# EAGLE design btmat (EAGLE 8.2.1)
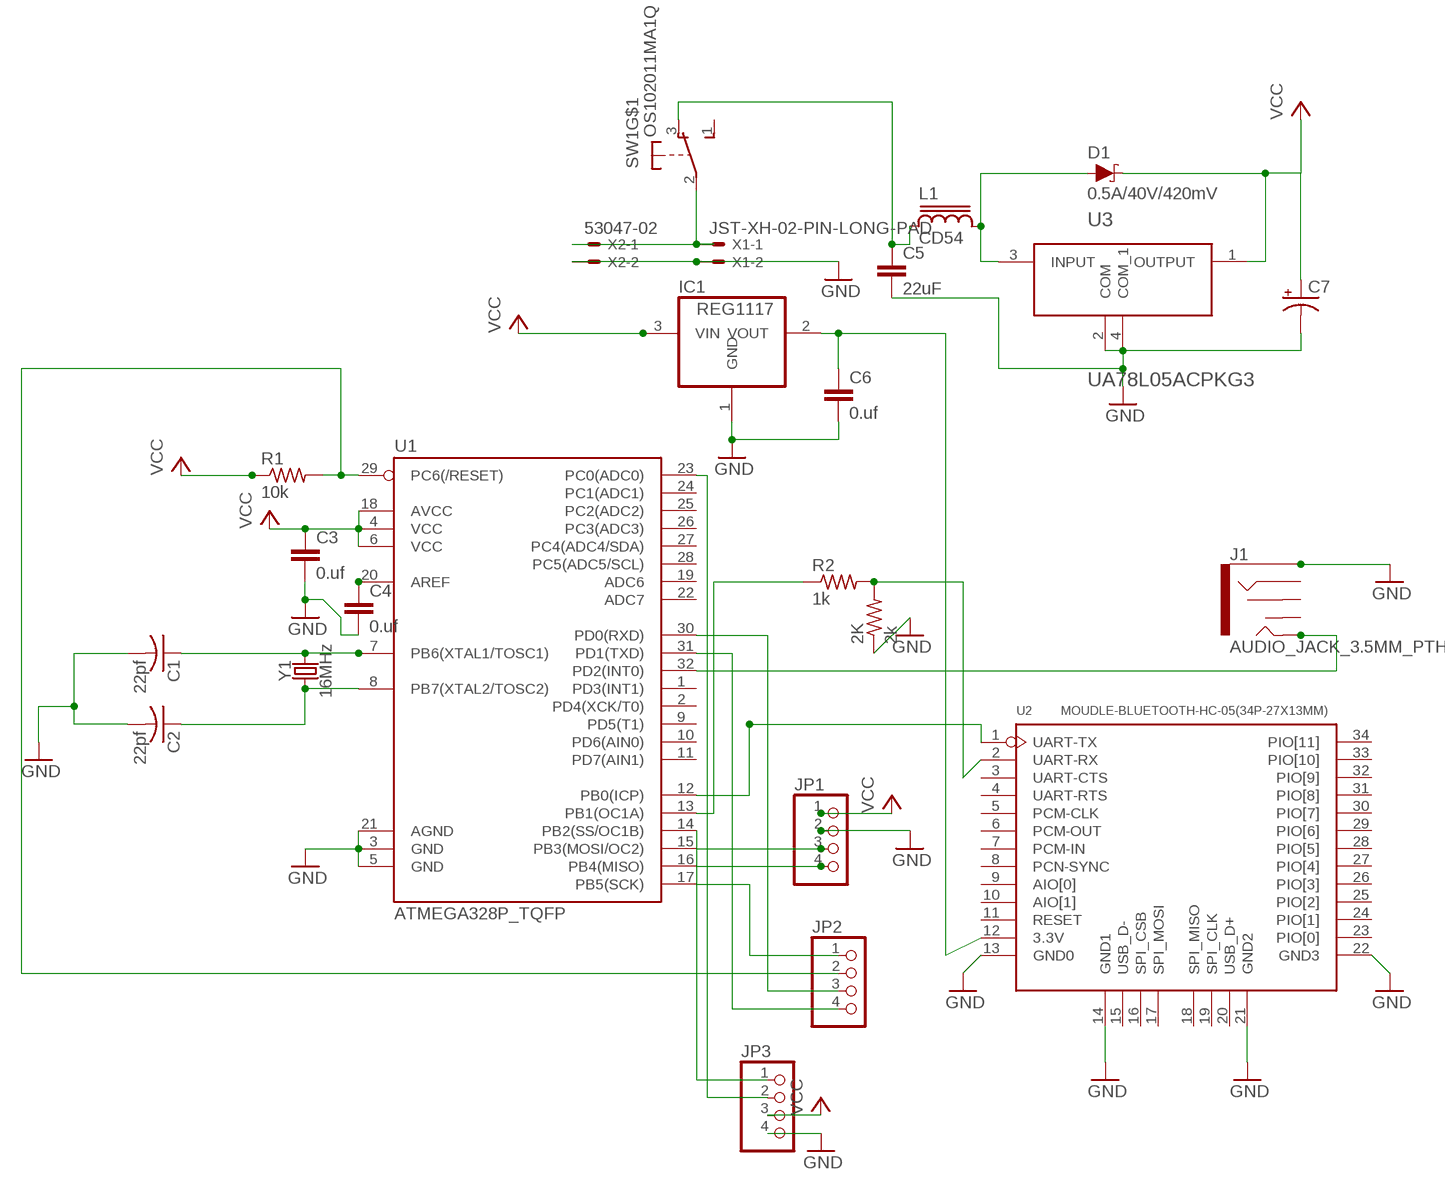
[diagram p0: schematic, sheet 1]

## Parts
2K  2k  R-US_R0805  [R0805]
C1  22pf  C-USC0805  [C0805]
C2  22pf  C-USC0805  [C0805]
C3  0.uf  C-EUC0805  [C0805]
C4  0.uf  C-EUC0805  [C0805]
C5  22uF  C-EUC0805  [C0805]
C6  0.uf  C-EUC0805  [C0805]
C7  CPOL-USC/6032-28R  [C/6032-28R]
D1  0.5A/40V/420mV  DIODE-SCHOTTKY-PMEG4005EJ  [SOD-323]
IC1  REG1117  [SOT223]
J1  AUDIO_JACK_3.5MM_PTH  [AUDIO-JACK]
JP1  PINHD-1X4  [1X04]
JP2  PINHD-1X4  [1X04]
JP3  PINHD-1X4  [1X04]
L1  CD54  [CD54]
R1  10k  R-US_R0805  [R0805]
R2  1k  R-US_R0805  [R0805]
SW1  OS102011MA1Q  [OS102011MA1Q]
U1  ATMEGA328P_TQFP  [TQFP32-08]
U2  MOUDLE-BLUETOOTH-HC-05(34P-27X13MM)  [BT34P-SMD-1.5-26.9X13.0X2.2MM]
U3  UA78L05ACPKG3  [SOT150P400X160-4N]
X1  JST-XH-02-PIN-LONG-PAD  [JST-XH-02-PACKAGE-LONG-PAD]
X2  53047-02  [53047-02]
Y1  16MHz  CRYSTAL-16MHZPTH-HC49US  [HC49US]

## Nets
GND: 2K.1 C1.2 C2.2 C3.2 C4.2 C5.2 C6.2 C7.- IC1.1(GND) J1.SLEEVE JP1.2 JP3.4 U1.3(GND) U1.5(GND) U1.21(AGND) U2.13(GND0) U2.14(GND1) U2.21(GND2) U2.22(GND3) U3.2(COM) U3.4(COM_1) X1.2 X2.2
N$1: C2.1 U1.8(PB7(XTAL2/TOSC2)) Y1.1
N$2: C1.1 U1.7(PB6(XTAL1/TOSC1)) Y1.2
N$3: JP2.2 R1.2 U1.29(PC6(/RESET))
N$4: C6.1 IC1.2(VOUT) U2.12(3.3V)
N$5: JP1.4 U1.16(PB4(MISO))
N$6: JP1.3 U1.15(PB3(MOSI/OC2))
N$7: JP2.1 U1.17(PB5(SCK))
N$8: U1.12(PB0(ICP)) U2.1(UART-TX)
N$9: JP2.4 U1.31(PD1(TXD))
N$10: JP2.3 U1.30(PD0(RXD))
N$11: D1.A L1.2 U3.3(INPUT)
N$12: C5.1 L1.1 SW1.3(O)
N$13: 2K.2 R2.2 U2.2(UART-RX)
N$14: SW1.2(P) X1.1 X2.1
N$16: R2.1 U1.13(PB1(OC1A))
N$17: C4.1 U1.20(AREF)
N$18: J1.TIP U1.32(PD2(INT0))
N$19: JP3.2 U1.23(PC0(ADC0))
N$22: JP3.1 U1.14(PB2(SS/OC1B))
VCC: C3.1 C7.+ D1.C IC1.3(VIN) JP1.1 JP3.3 R1.1 U1.4(VCC) U1.6(VCC) U1.18(AVCC) U3.1(OUTPUT)
Unconnected: J1.RING J1.RSH J1.TSH SW1.1(S) SW1.MT1(MT) SW1.MT2(MT) U1.1(PD3(INT1)) U1.2(PD4(XCK/T0)) U1.9(PD5(T1)) U1.10(PD6(AIN0)) U1.11(PD7(AIN1)) U1.19(ADC6) U1.22(ADC7) U1.24(PC1(ADC1)) U1.25(PC2(ADC2)) U1.26(PC3(ADC3)) U1.27(PC4(ADC4/SDA)) U1.28(PC5(ADC5/SCL)) U2.3(UART-CTS) U2.4(UART-RTS) U2.5(PCM-CLK) U2.6(PCM-OUT) U2.7(PCM-IN) U2.8(PCN-SYNC) U2.9(AIO[0]) U2.10(AIO[1]) U2.11(RESET) U2.15(USB_D-) U2.16(SPI_CSB) U2.17(SPI_MOSI) U2.18(SPI_MISO) U2.19(SPI_CLK) U2.20(USB_D+) U2.23(PIO[0]) U2.24(PIO[1]) U2.25(PIO[2]) U2.26(PIO[3]) U2.27(PIO[4]) U2.28(PIO[5]) U2.29(PIO[6]) U2.30(PIO[7]) U2.31(PIO[8]) U2.32(PIO[9]) U2.33(PIO[10]) U2.34(PIO[11])

## Library data of the parts
2K R1 R2 = resistor:R-US_: RESISTOR, American symbol
C1 C2 = resistor:C-US: CAPACITOR, American symbol
C3 C4 C6 = resistor:C-EU: CAPACITOR, European symbol
C5 = rcl:C-EU: CAPACITOR, European symbol
C7 = rcl:CPOL-US: POLARIZED CAPACITOR, American symbol
D1 = SparkFun-DiscreteSemi:DIODE-SCHOTTKY: Schottky diode A Schottky diode is a semiconductor diode which has a low forward voltage drop and a very fast switching action.; PROD_ID: DIO-10955
IC1 = burr-brown:REG1117: 800mA and 1A Low Dropout (LDO) Positive Regulator 1.8V, 2.5V, 2.85V, 3.3V, 5V, and Adj; MPN: REG1117; OC_FARNELL: 1097566; OC_NEWARK: 14P6981
J1 = SparkFun-Connectors:AUDIO_JACK_3.5MM: Audio Jack 3.5mm variants of PTH and SMT stereo audio jack with bypass switches. SparkFun Products: SparkFun SparkPunk Sound Kit <[https://www.sparkfun.com/products/11177]> - PTH MP3 Trigger <https://www.sparkfun.com/products/13720> -3.5mm SMD SparkFun PicoBoard <https://www.sparkfun.com/products/11888>- 2.5mm SMD; PROD_ID: CONN-08774; SF_ID: PRT-08032
JP1-JP3 = pinhead:PINHD-1X4: PIN HEADER
L1 = inductor-sumida:CD54: POWER INDUCTOR
SW1 = adafruit:OS102011MA1Q: OS10201MA1Q through-hole right angle switch http://www.ladyada.net/library/eagle
U1 = SparkFun-IC-Microcontroller:ATMEGA328P_TQFP: Popular 328P in QFP Storefront component: ATmega328 - TQFP <https://www.sparkfun.com/products/13448> (COM-13448) Datasheet <http://www.sparkfun.com/datasheets/Components/SMD/ATMega328.pdf> SparkFun Products SparkFun RedBoard - Programmed with Arduino <https://www.sparkfun.com/products/12757> (DEV-12757) Arduino Pro Mini 328 - 5V/16MHz <https://www.sparkfun.com/products/11113> (DEV-11113) Arduino Pro Mini 328 - 3.3V/8MHz <https://www.sparkfun.com/products/11114> (DEV-11114) SparkFun OpenLog <https://www.sparkfun.com/products/13712> (DEV-13712) SparkFun MicroView - OLED Arduino Module <https://www.sparkfun.com/products/12923> (DEV-12923) SparkFun Digital Sandbox <https://www.sparkfun.com/products/12651> (DEV-12651) SparkFun PicoBoard <https://www.sparkfun.com/products/11888> (WIG-11888) Arduino Fio <https://www.sparkfun.com/products/10116> (DEV-10116) LilyPad Arduino 328 Main Board <https://www.sparkfun.com/products/13342> (DEV-13342) SparkFun RedStick <https://www.sparkfun.com/products/13741> (DEV-13741) LilyPad MP3 <https://www.sparkfun.com/products/11013> (DEV-11013) LilyPad Arduino SimpleSnap <https://www.sparkfun.com/products/10941> (DEV-10941) SparkFun Stepoko <https://www.sparkfun.com/products/13899> (ROB-13899) SparkFun Geiger Counter <https://www.sparkfun.com/products/11345> (SEN-11345) SparkFun EL Sequencer <https://www.sparkfun.com/products/12781> (COM-12781) Arduino Pro 328 - 5V/16MHz <https://www.sparkfun.com/products/10915> (DEV-10915) CryptoCape <https://www.sparkfun.com/products/12773> (DEV-12773) SparkFun IR Thermometer Evaluation Board - MLX90614 <https://www.sparkfun.com/products/10740> (SEN-10740) SparkFun RedBot Mainboard <https://www.sparkfun.com/products/12097> (ROB-12097) Arduino Pro 328 - 3.3V/8MHz <https://www.sparkfun.com/products/10914> (DEV-10914) SparkFun Block for Intel® Edison - Arduino <https://www.sparkfun.com/products/13036> (DEV-13036) SparkFun Simon Says - Surface Mount Soldering Kit <https://www.sparkfun.com/products/10935> (KIT-10935) SparkFun 7-Segment Serial Display - Red <https://www.sparkfun.com/products/11441> (COM-11441) SparkFun 7-Segment Serial Display - White <https://www.sparkfun.com/products/11629> (COM-11629) SparkFun 7-Segment Serial Display - Yellow <https://www.sparkfun.com/products/11443> (COM-11443) SparkFun 7-Segment Serial Display - Kelly Green <https://www.sparkfun.com/products/11440> (COM-11440) SparkFun 7-Segment Serial Display - Blue <https://www.sparkfun.com/products/11442> (COM-11442) SparkFun OpenSegment Serial Display - 20mm (Blue) <https://www.sparkfun.com/products/11647> (COM-11647) SparkFun OpenSegment Serial Display - 20mm (Green) <https://www.sparkfun.com/products/11646> (COM-11646) SparkFun OpenSegment Serial Display - 20mm (White) <https://www.sparkfun.com/products/11648> (COM-11648) SparkFun OpenSegment Serial Display - 20mm (Red) <https://www.sparkfun.com/products/11644> (COM-11644) SparkFun OpenSegment Serial Display - 20mm (Yellow) <https://www.sparkfun.com/products/11645> (COM-11645) SparkFun OpenSegment Shield <https://www.sparkfun.com/products/13190> (DEV-13190); PROD_ID: IC-09069
U2 = MOUDLE-BLUETOOTH-HC-05_34P-27X13MM_:MOUDLE-BLUETOOTH-HC-05(34P-27X13MM): 317030002; AVAILABILITY: Unavailable; DESCRIPTION: None; MP: HC-05; PACKAGE: None; PRICE: None
U3 = TI-Eagle_library:UA78L05: μA78L00 SERIES POSITIVE-VOLTAGE REGULATORS,SOT-89-3; MPN: UA78L05ACPKG3; OC_FARNELL: 1236590; OC_NEWARK: 13M5626; PACKAGE: SOT-89-3; SUPPLIER: TEXAS INSTRUMENTS
X1 = Rembrandt Electronics - JST XH Connectors v1-0:JST-XH-02-PIN: JST XH Connector 2 Pin Wire to board connector. Pitch: 2,54 mm, (0.100") Number of pins: 2 Created by Rembrandt Electronics www.rembrandtelectronics.com
X2 = con-molex:53?-02: CONNECTOR wire to board 1.25 mm (.049 inch) pitch header; MF: MOLEX; MPN: 53047-0210; OC_FARNELL: 9733051; OC_NEWARK: 57H4701
Y1 = SparkFun-Clocks:CRYSTAL-16MHZ: 16MHz Crystal Digikey Example <http://www.digikey.com/product-search/en?keywords=535-9122-1-ND> Frequency: 16MHz Frequency Stability: ±50ppm Frequency Tolerance: ±20ppm Load Capacitance: 18pF SparkFun Products: Pro Micro -5V/16MHz <https://www.sparkfun.com/products/12640> SparkFun Serial Enabled LCD Kit <https://www.sparkfun.com/products/10097>; PROD_ID: XTAL-08181; SF_ID: COM-00536

## Net classes
0 default: width 0.305 mm

## Board
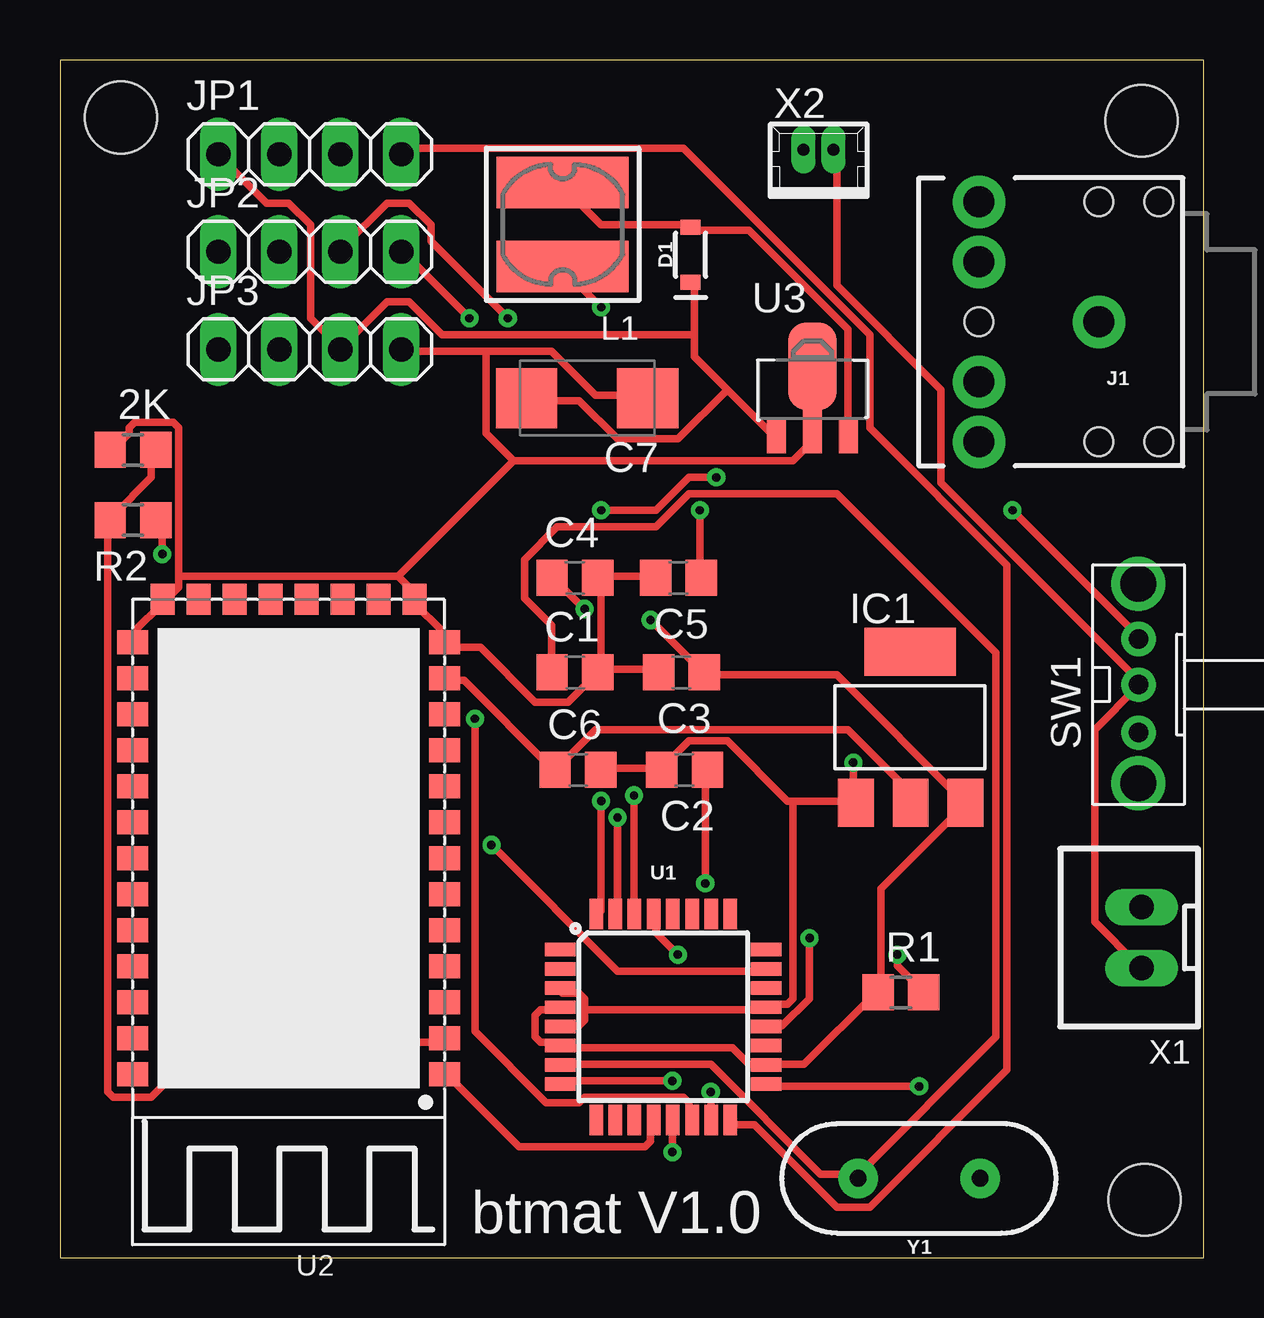
[diagram p1: board, top side]
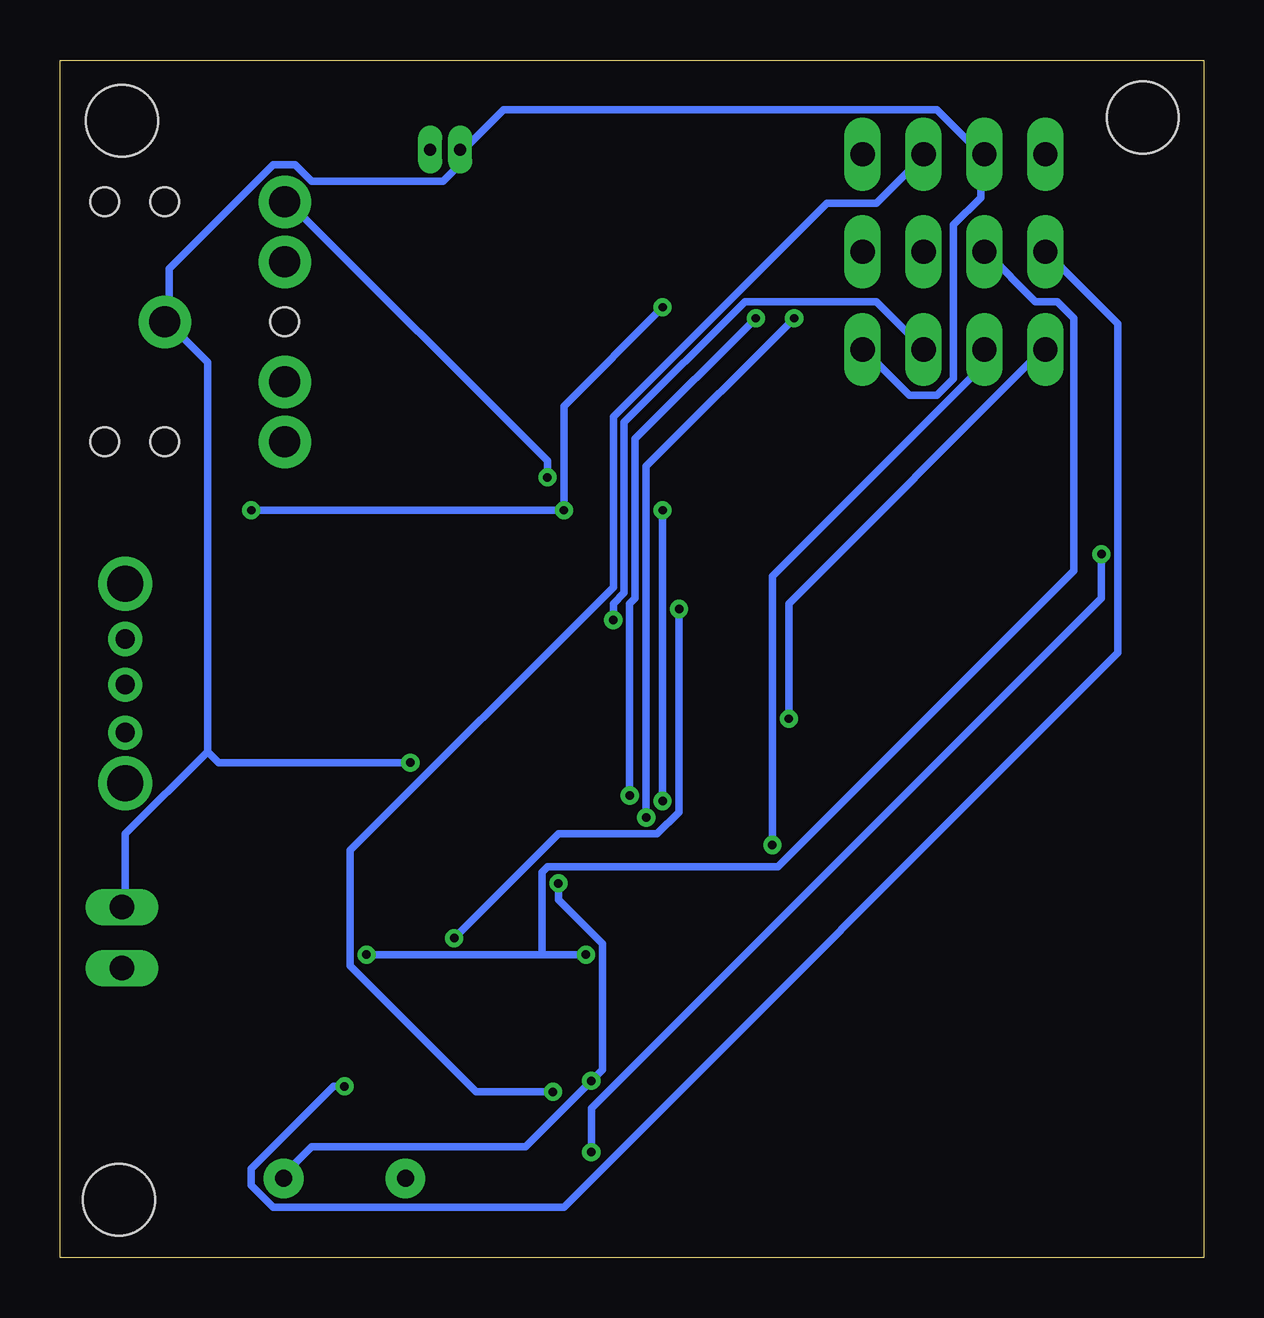
[diagram p2: board, bottom side, seen from below]

Size 47.68 x 49.9 mm. Coordinates in mm from the lower left corner, seen from the top.
Outline: 0,0 47.68,0 47.68,49.9 0,49.9 0,0
Copper layers (1*16): Top 0.035mm / dielectric 1.5mm / Bottom 0.035mm
Design rules "default": minimum track width 6mil, minimum drill 0.35mm, track to track 6mil, track to pad 6mil, pad to pad 6mil, via to via 6mil, smd to smd 6mil, copper to edge 40mil, drill to drill 6mil, minimum pad ring 10mil, minimum via ring 8mil, stop-mask expansion 4mil, vias tented up to drill 0mil, thermal gap 10mil
Holes 3 mm at 2.54,47.5 45.21,2.41 45.09,47.37

### Footprints (pad centres in the part's own frame; a part is rotated, then mirrored left to right if it is on the bottom)
R0805 = smd 1.3 x 1.5: 1 -0.95,0; 2 0.95,0
C0805 = smd 1.3 x 1.5: 1 -0.95,0; 2 0.95,0
C/6032-28R = smd 2.55 x 2.5: + 2.525,0; - -2.525,0
SOD-323 = smd 0.63 x 0.83: A 1.15,0; C -1.15,0
SOT223 = smd 1.499 x 2.007: 1 -2.261,-3.15; 2 0.025,-3.15; 3 2.311,-3.15 | smd 3.81 x 2.007: 4 0,3.15
AUDIO-JACK = drill 1.3 pad 2.184: RING 5,5; RSH 5,2.5; SLEEVE 0,0; TIP 5,-5; TSH 5,-2.5 | hole 1.2: 0,5; -2.5,5; -2.5,-5; 0,-5; 5,0
1X04 = drill 1.016 long: 1 -3.81,0; 2 -1.27,0; 3 1.27,0; 4 3.81,0
CD54 = smd 5.5 x 2.15: 1 0,1.75; 2 0,-1.75
OS102011MA1Q = drill 0.8 pad 1.422: 1 -2,0; 2 0,0; 3 1.9,0 | drill 1.5 pad 2.184: MT1 -4.1,0; MT2 4.2,0
TQFP32-08 = smd 1.27 x 0.559: 1 -4.293,2.8; 2 -4.293,2; 3 -4.293,1.2; 4 -4.293,0.4; 5 -4.293,-0.4; 6 -4.293,-1.2; 7 -4.293,-2; 8 -4.293,-2.8; 17 4.293,-2.8; 18 4.293,-2; 19 4.293,-1.2; 20 4.293,-0.4; 21 4.293,0.4; 22 4.293,1.2; 23 4.293,2; 24 4.293,2.8 | smd 0.559 x 1.27: 9 -2.8,-4.293; 10 -2,-4.293; 11 -1.2,-4.293; 12 -0.4,-4.293; 13 0.4,-4.293; 14 1.2,-4.293; 15 2,-4.293; 16 2.8,-4.293; 25 2.8,4.293; 26 2,4.293; 27 1.2,4.293; 28 0.4,4.293; 29 -0.4,4.293; 30 -1.2,4.293; 31 -2,4.293; 32 -2.8,4.293
BT34P-SMD-1.5-26.9X13.0X2.2MM = smd 1.3 x 1: 1 -6.5,19.8; 2 -6.5,18.3; 3 -6.5,16.8; 4 -6.5,15.3; 5 -6.5,13.8; 6 -6.5,12.3; 7 -6.5,10.8; 8 -6.5,9.3; 9 -6.5,7.8; 10 -6.5,6.3; 11 -6.5,4.8; 12 -6.5,3.3; 13 -6.5,1.8; 22 6.5,1.8; 23 6.5,3.3; 24 6.5,4.8; 25 6.5,6.3; 26 6.5,7.8; 27 6.5,9.3; 28 6.5,10.8; 29 6.5,12.3; 30 6.5,13.8; 31 6.5,15.3; 32 6.5,16.8; 33 6.5,18.3; 34 6.5,19.8 | smd 1 x 1.3: 14 -5.25,0; 15 -3.75,0; 16 -2.25,0; 17 -0.75,0; 18 0.75,0; 19 2.25,0; 20 3.75,0; 21 5.25,0
SOT150P400X160-4N = smd 0.8 x 1.4: 1 -1.499,-1.981; 3 1.499,-1.981 | smd 0.8 x 1.9: 2 0,-1.727 | smd 2.032 x 3.65: 4 0,0.94
JST-XH-02-PACKAGE-LONG-PAD = drill 1.016 long: 1 -1.27,0; 2 1.27,0
53047-02 = drill 0.5 pad 0.698 long: 1 0.625,0.45; 2 -0.625,0.45
HC49US = drill 0.7 pad 1.651: 1 -2.54,0; 2 2.54,0

### Placement (x,y rotation side)
2K  3.05,33.66 0 top
C1  21.46,24.38 0 top
C2  26.03,20.32 180 top
C3  25.91,24.38 180 top
C4  21.46,28.32 0 top
C5  25.78,28.32 180 top
C6  21.59,20.32 0 top
C7  21.97,35.81 180 top
D1  26.29,41.78 90 top
IC1  35.43,22.1 0 top
J1  43.31,38.99 180 top
JP1  10.41,45.97 0 top
JP2  10.41,41.91 0 top
JP3  10.41,37.85 0 top
L1  20.95,43.05 180 top
R1  35.05,11.05 0 top
R2  3.05,30.73 180 top
SW1  44.96,23.88 90 top
U1  25.15,10.03 0 top
U2  9.53,27.43 180 top
U3  31.37,36.19 0 top
X1  45.09,13.34 90 top
X2  31.62,45.72 0 top
Y1  35.81,3.3 180 top

### Tracks (layer width: path | path; a pad name or v marks a point on that pad's centre or on a via)
GND  (via drill 0.35)
  Top 0.305: U2.22 3.12,25.65 3.12,26.11 4.27,27.25 U2.21 4.5,27.48 4.95,27.94 4.95,28.4 | 4.95,28.4 4.95,34.57 4.72,34.8 3.12,34.8 2.9,34.57 2.9,34.34 2.21,33.66 2K.1 | C5.2 24.61,28.4 22.55,28.4 C4.2 22.55,28.17 22.55,24.51 | 22.55,24.51 24.84,24.51 C3.2 | 22.55,24.51 C1.2 22.33,24.28 21.18,23.14 19.81,23.14 17.53,25.42 16.15,25.42 U2.13 15.93,25.65 15.93,26.11 14.78,27.25 U2.14 14.55,27.48 14.55,27.94 14.1,28.4 | 14.1,28.4 4.95,28.4 | U3.4 31.47,37.08 31.47,34.57 U3.2 31.24,34.34 31.24,33.88 30.56,33.2 18.9,33.2 | 17.75,37.77 14.33,37.77 JP3.4 | 17.75,37.77 20.5,37.77 22.33,35.94 24.38,35.94 C7.- | 18.9,33.2 17.75,34.34 17.75,37.77 | 18.9,33.2 14.1,28.4 | 21.87,10.34 21.87,10.8 21.64,11.02 20.95,11.02 U1.3 | 21.87,10.34 21.87,9.88 21.64,9.65 20.95,9.65 U1.5 | 21.87,10.34 29.41,10.34 U1.21 29.64,10.57 30.33,10.57 30.56,10.8 30.56,19.02 | 25.07,20.4 22.55,20.4 C6.2 | 30.56,19.02 30.33,19.02 27.81,21.54 26.21,21.54 25.07,20.4 | 30.56,19.02 33.07,19.02 | 25.07,20.4 C2.2 | v33.07,20.62 33.07,19.02 | 33.07,19.02 IC1.1
  Bottom 0.305: JP3.4 14.1,37.77 12.27,35.94 11.12,35.94 10.44,36.63 10.44,43.03 9.3,44.17 9.3,45.77 JP1.2 9.3,46 11.12,47.83 29.18,47.83 30.78,46.23 X2.2 31.01,46 31.01,45.54 31.7,44.86 37.19,44.86 37.87,45.54 38.79,45.54 43.13,41.2 43.13,39.14 J1.SLEEVE 43.13,38.91 41.53,37.31 41.53,21.08 | 41.53,21.08 44.96,17.65 44.96,14.68 X1.2 | v33.07,20.62 41.07,20.62 41.53,21.08
N$1  (via drill 0.35)
  Top 0.305: v25.53,7.37 20.95,7.37 U1.8 | v26.9,15.6 26.9,20.17 C2.1
  Bottom 0.305: Y1.1 38.33,3.48 37.19,4.62 28.27,4.62 v25.53,7.37 25.07,7.82 25.07,13.08 26.9,14.91 v26.9,15.6
N$2
  Top 0.305: U1.7 20.95,8.05 27.13,8.05 31.7,3.48 33.07,3.48 Y1.2 33.3,3.48 39.01,9.2 39.01,25.2 32.38,31.83 26.21,31.83 24.84,30.45 20.73,30.45 19.35,29.08 19.35,27.48 20.5,26.34 20.5,24.51 C1.1
N$3  (via drill 0.35)
  Top 0.305: v25.76,12.62 24.84,13.54 24.84,14.22 U1.29 | v34.9,12.62 34.9,12.17 35.81,11.25 R1.2
  Bottom 0.305: v34.9,12.62 27.58,12.62 | 27.58,12.62 v25.76,12.62 | 27.58,12.62 27.58,16.05 27.36,16.28 17.75,16.28 5.41,28.63 5.41,39.14 6.1,39.83 7.01,39.83 9.07,41.89 JP2.2
N$4
  Top 0.305: U2.12 16.15,24.05 16.84,24.05 20.5,20.4 C6.1 20.73,20.4 22.33,22 32.84,22 35.36,19.48 35.36,19.02 IC1.2
N$5
  Top 0.305: U1.16 28.04,5.54 28.96,5.54 32.38,2.11 33.76,2.11 39.47,7.82 39.47,28.85 33.76,34.57 33.76,38.46 25.98,46.23 14.55,46.23 14.33,46 JP1.4
N$6  (via drill 0.35)
  Top 0.305: v27.13,6.91 27.13,5.77 U1.15
  Bottom 0.305: v27.13,6.91 30.33,6.91 35.59,12.17 35.59,16.97 24.61,27.94 24.61,35.03 15.7,43.94 13.64,43.94 11.81,45.77 JP1.3
N$7  (via drill 0.35)
  Top 0.305: v35.81,7.14 29.64,7.14 U1.17
  Bottom 0.305: v35.81,7.14 36.27,7.14 39.7,3.71 39.7,3.02 38.79,2.11 26.67,2.11 3.58,25.2 3.58,38.91 6.55,41.89 JP2.1
N$8
  Top 0.305: U1.12 24.61,5.54 24.61,4.85 24.38,4.62 19.13,4.62 16.15,7.59 U2.1
N$9  (via drill 0.35)
  Top 0.305: v23.24,18.34 23.24,14.45 U1.31 | v17.07,39.14 14.33,41.89 JP2.4
  Bottom 0.305: v23.24,18.34 23.24,32.97 v17.07,39.14
N$10  (via drill 0.35)
  Top 0.305: v23.93,19.25 23.93,14.45 U1.30 | v18.67,39.14 15.47,42.34 15.47,43.03 14.55,43.94 13.64,43.94 11.81,42.11 JP2.3
  Bottom 0.305: v23.93,19.25 23.93,27.25 23.7,27.48 23.7,34.11 v18.67,39.14
N$11
  Top 0.305: L1.2 20.95,44.63 22.55,43.03 26.21,43.03 D1.A 26.44,42.8 28.73,42.8 32.84,38.68 32.84,34.34 U3.3
N$12  (via drill 0.35)
  Top 0.305: v26.67,31.14 26.67,28.4 C5.1 | v22.55,39.6 20.95,41.2 L1.1 | v39.7,31.14 44.96,25.88 SW1.3
  Bottom 0.305: v22.55,39.6 26.67,35.48 v26.67,31.14 v39.7,31.14
N$13
  Top 0.305: U2.2 15.93,8.97 6.1,8.97 3.81,6.68 2.21,6.68 1.98,6.91 1.98,30.68 R2.2 2.21,30.91 3.81,32.51 3.81,33.66 2K.2
N$14
  Top 0.305: X2.1 32.38,46 32.38,40.51 36.73,36.17 36.73,32.28 44.96,24.05 SW1.2 44.96,23.83 43.13,22 43.13,13.99 44.96,12.17 X1.1
N$16  (via drill 0.35)
  Top 0.305: v25.53,4.39 25.53,5.54 U1.13 | v4.27,29.31 4.27,30.45 4.04,30.68 R2.1
  Bottom 0.305: v25.53,4.39 25.53,6.22 4.27,27.48 v4.27,29.31
N$17  (via drill 0.35)
  Top 0.305: v31.24,13.31 31.24,10.8 30.1,9.65 29.64,9.65 U1.20 | v21.87,27.03 20.73,28.17 C4.1
  Bottom 0.305: v31.24,13.31 26.9,17.65 22.78,17.65 21.87,18.57 v21.87,27.03
N$18  (via drill 0.35)
  Top 0.305: v22.55,19.02 22.55,14.45 U1.32 | v22.55,31.14 24.84,31.14 26.21,32.51 v27.36,32.51
  Bottom 0.305: v22.55,31.14 v22.55,19.02 | v27.36,32.51 27.36,33.2 38.1,43.94 J1.TIP
N$19  (via drill 0.35)
  Top 0.305: v17.98,17.2 23.24,11.94 29.41,11.94 U1.23
  Bottom 0.305: v17.98,17.2 17.98,28.4 9.3,37.08 9.3,37.77 JP3.2
N$22  (via drill 0.35)
  Top 0.305: v17.3,22.45 17.3,9.42 20.27,6.45 21.64,6.45 21.87,6.68 25.98,6.68 26.21,6.45 26.21,5.77 U1.14
  Bottom 0.305: v17.3,22.45 17.3,27.25 6.78,37.77 JP3.1
VCC  (via drill 0.35)
  Top 0.305: U1.4 20.73,10.34 20.04,10.34 19.81,10.11 19.81,9.2 20.04,8.97 20.73,8.97 U1.6 20.95,8.74 28.04,8.74 28.73,8.05 29.41,8.05 U1.18 29.64,8.05 31.01,8.05 33.98,11.02 R1.1 34.21,11.25 34.21,15.37 37.64,18.8 IC1.3 37.64,19.02 32.38,24.28 26.9,24.28 C3.1 26.67,24.51 v24.61,26.57 | 26.44,38.46 26.44,37.54 27.81,36.17 | 26.44,38.46 26.44,40.51 D1.C | 27.81,36.17 29.64,34.34 U3.1 | 27.81,36.17 25.76,34.11 23.24,34.11 21.64,35.71 19.58,35.71 C7.+ | JP1.1 6.78,45.77 8.61,43.94 9.53,43.94 10.44,43.03 10.44,39.14 11.58,38 JP3.3 11.81,38 13.64,39.83 14.55,39.83 15.93,38.46 26.44,38.46
  Bottom 0.305: v24.61,26.57 24.61,27.25 24.16,27.71 24.16,34.8 19.13,39.83 13.64,39.83 11.81,38 JP3.3

### Text on the board
tPlace: btmat V1.0